# EAGLE design Mirtle_H-Bridge_proto_shield_DRV8833 (EAGLE 7.6.0)
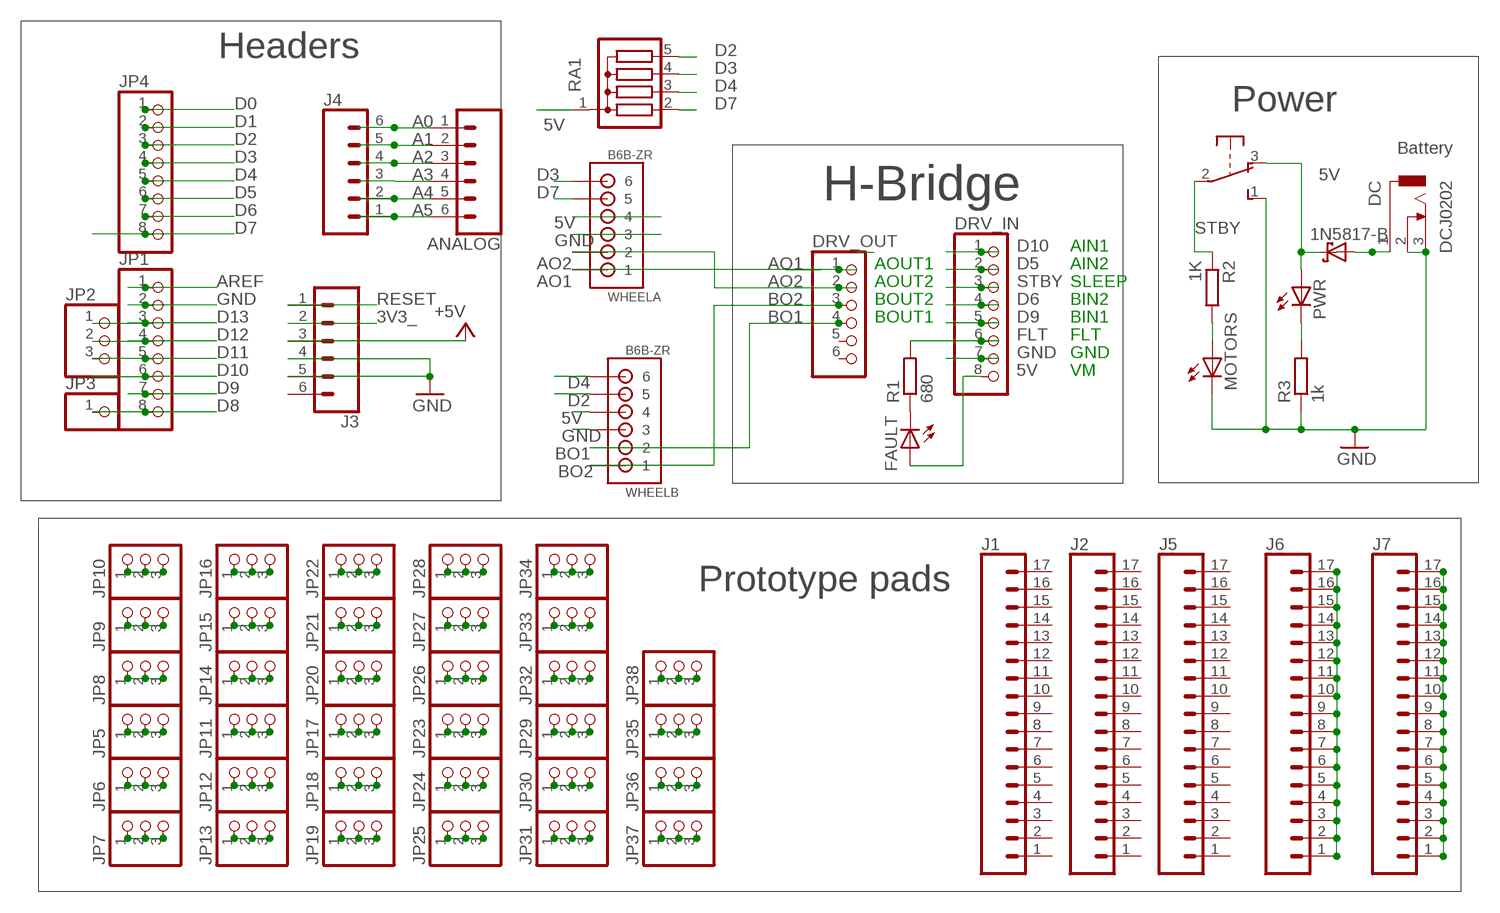
[diagram p0: schematic, sheet 1]

## Parts
ANALOG  CONN_06NO_SILK_FEMALE_PTH  [1X06_NO_SILK]
D1  1N5817-B  [DO41-7.6]
DC  DCJ0202  [DCJ0202]
DRV_IN  HEADER-1X870MIL  [1X08_ROUND_70]
DRV_OUT  PINHD-1X6CLEAN  [1X06-CLEAN]
FAULT  LED3MM  [LED3MM]
J1  CONN_17NOSILK  [1X17_NO_SILK]
J2  CONN_17NOSILK  [1X17_NO_SILK]
J3  CONN_06NO_SILK_FEMALE_PTH  [1X06_NO_SILK]
J4  CONN_06NO_SILK_FEMALE_PTH  [1X06_NO_SILK]
J5  CONN_17NOSILK  [1X17_NO_SILK]
J6  CONN_17NOSILK  [1X17_NO_SILK]
J7  CONN_17NOSILK  [1X17_NO_SILK]
JP1  PINHD-1X8CLEANBIG  [1X08-CLEANBIG]
JP2  PINHD-1X3  [1X03]
JP3  PINHD-1X1  [1X01]
JP4  PINHD-1X8CLEANBIG  [1X08-CLEANBIG]
JP5  PINHD-1X3CB  [1X03-CLEANBIG]
JP6  PINHD-1X3CB  [1X03-CLEANBIG]
JP7  PINHD-1X3CB  [1X03-CLEANBIG]
JP8  PINHD-1X3CB  [1X03-CLEANBIG]
JP9  PINHD-1X3CB  [1X03-CLEANBIG]
JP10  PINHD-1X3CB  [1X03-CLEANBIG]
JP11  PINHD-1X3CB  [1X03-CLEANBIG]
JP12  PINHD-1X3CB  [1X03-CLEANBIG]
JP13  PINHD-1X3CB  [1X03-CLEANBIG]
JP14  PINHD-1X3CB  [1X03-CLEANBIG]
JP15  PINHD-1X3CB  [1X03-CLEANBIG]
JP16  PINHD-1X3CB  [1X03-CLEANBIG]
JP17  PINHD-1X3CB  [1X03-CLEANBIG]
JP18  PINHD-1X3CB  [1X03-CLEANBIG]
JP19  PINHD-1X3CB  [1X03-CLEANBIG]
JP20  PINHD-1X3CB  [1X03-CLEANBIG]
JP21  PINHD-1X3CB  [1X03-CLEANBIG]
JP22  PINHD-1X3CB  [1X03-CLEANBIG]
JP23  PINHD-1X3CB  [1X03-CLEANBIG]
JP24  PINHD-1X3CB  [1X03-CLEANBIG]
JP25  PINHD-1X3CB  [1X03-CLEANBIG]
JP26  PINHD-1X3CB  [1X03-CLEANBIG]
JP27  PINHD-1X3CB  [1X03-CLEANBIG]
JP28  PINHD-1X3CB  [1X03-CLEANBIG]
JP29  PINHD-1X3CB  [1X03-CLEANBIG]
JP30  PINHD-1X3CB  [1X03-CLEANBIG]
JP31  PINHD-1X3CB  [1X03-CLEANBIG]
JP32  PINHD-1X3CB  [1X03-CLEANBIG]
JP33  PINHD-1X3CB  [1X03-CLEANBIG]
JP34  PINHD-1X3CB  [1X03-CLEANBIG]
JP35  PINHD-1X3CB  [1X03-CLEANBIG]
JP36  PINHD-1X3CB  [1X03-CLEANBIG]
JP37  PINHD-1X3CB  [1X03-CLEANBIG]
JP38  PINHD-1X3CB  [1X03-CLEANBIG]
MOTORS  LED3MM  [LED3MM]
PWR  LED3MM  [LED3MM]
R1  680  R-EU_0204/7  [0204/7]
R2  1K  R-EU_0204/7  [0204/7]
R3  1k  R-EU_0204/7  [0204/7]
RA1  G04R  [SIL5]
SW1  OS102011MA1Q  [OS102011MA1Q]
WHEELA  B6B-ZR  [B6B-ZR]
WHEELB  B6B-ZR  [B6B-ZR]

## Nets
3V3_: J3.2
5V: D1.C DRV_IN.8 FAULT.A J3.3 J7.1 J7.2 J7.3 J7.4 J7.5 J7.6 J7.7 J7.8 J7.9 J7.10 J7.11 J7.12 J7.13 J7.14 J7.15 J7.16 J7.17 PWR.A RA1.1 SW1.3(O) WHEELA.4 WHEELB.4 ; supply symbol labelled +5V
5VIN: D1.A DC.1
A0: ANALOG.1 J4.6
A1: ANALOG.2 J4.5
A2: ANALOG.3 J4.4
A3: ANALOG.4 J4.3
A4: ANALOG.5 J4.2
A5: ANALOG.6 J4.1
AO1: DRV_OUT.1 WHEELA.1
AO2: DRV_OUT.2 WHEELA.2
AREF: JP1.1
BO1: DRV_OUT.4 WHEELB.2
BO2: DRV_OUT.3 WHEELB.1
D0: JP4.1
D1: JP4.2
D2: JP4.3 RA1.5 WHEELB.5
D3: JP4.4 RA1.4 WHEELA.6
D4: JP4.5 RA1.3 WHEELB.6
D5: DRV_IN.2 JP4.6
D6: DRV_IN.4 JP4.7
D7: JP4.8 RA1.2 WHEELA.5
D8: JP1.8 JP3.1
D9: DRV_IN.5 JP1.7
D10: DRV_IN.1 JP1.6
D11: JP1.5 JP2.3
D12: JP1.4 JP2.2
D13: JP1.3 JP2.1
FLT: DRV_IN.6 R1.2
GND: DC.2 DC.3 DRV_IN.7 J3.4 J3.5 J6.1 J6.2 J6.3 J6.4 J6.5 J6.6 J6.7 J6.8 J6.9 J6.10 J6.11 J6.12 J6.13 J6.14 J6.15 J6.16 J6.17 JP1.2 MOTORS.K(C) R3.1 SW1.1(S) WHEELA.3 WHEELB.3
N$5: PWR.K(C) R3.2
N$10: FAULT.K(C) R1.1
N$12: JP7.1 JP7.2 JP7.3 JP10.1 JP10.2 JP10.3 JP11.1 JP11.2 JP11.3 JP12.1 JP12.2 JP12.3 JP13.1 JP13.2 JP13.3 JP14.1 JP14.2 JP14.3 JP15.1 JP15.2 JP15.3 JP16.1 JP16.2 JP16.3 JP22.1 JP22.2 JP22.3 JP28.1 JP28.2 JP28.3 JP34.1 JP34.2 JP34.3
N$15: JP9.1 JP9.2 JP9.3
N$16: MOTORS.A R2.2
N$17: JP8.1 JP8.2 JP8.3
N$24: JP5.1 JP5.2 JP5.3
N$27: JP17.1 JP17.2 JP17.3 JP18.1 JP18.2 JP18.3 JP19.1 JP19.2 JP19.3 JP20.1 JP20.2 JP20.3 JP21.1 JP21.2 JP21.3 JP23.1 JP23.2 JP23.3 JP24.1 JP24.2 JP24.3 JP25.1 JP25.2 JP25.3 JP26.1 JP26.2 JP26.3 JP27.1 JP27.2 JP27.3 JP29.1 JP29.2 JP29.3 JP30.1 JP30.2 JP30.3 JP31.1 JP31.2 JP31.3 JP32.1 JP32.2 JP32.3 JP33.1 JP33.2 JP33.3 JP35.1 JP35.2 JP35.3 JP36.1 JP36.2 JP36.3 JP37.1 JP37.2 JP37.3 JP38.1 JP38.2 JP38.3
N$31: JP6.1 JP6.2 JP6.3
RESET: J3.1
STBY: DRV_IN.3 R2.1 SW1.2(P)
Unconnected: DRV_OUT.5 DRV_OUT.6 J1.1 J1.2 J1.3 J1.4 J1.5 J1.6 J1.7 J1.8 J1.9 J1.10 J1.11 J1.12 J1.13 J1.14 J1.15 J1.16 J1.17 J2.1 J2.2 J2.3 J2.4 J2.5 J2.6 J2.7 J2.8 J2.9 J2.10 J2.11 J2.12 J2.13 J2.14 J2.15 J2.16 J2.17 J3.6 J5.1 J5.2 J5.3 J5.4 J5.5 J5.6 J5.7 J5.8 J5.9 J5.10 J5.11 J5.12 J5.13 J5.14 J5.15 J5.16 J5.17 SW1.MT1(MT) SW1.MT2(MT)

## Notes on the sheet
- Headers
- Power
- Battery
- H-Bridge
- AIN1
- AOUT1 | AIN2
- AOUT2 | SLEEP
- BOUT2 | BIN2
- BOUT1 | BIN1
- FLT
- GND
- VM
- Prototype pads

## Library data of the parts
ANALOG J3 J4 = SparkFun-Connectors:CONN_06: Multi connection point. Often used as Generic Header-pin footprint for 0.1 inch spaced/style header connections On any of the 0.1 inch spaced packages, you can populate with these: Break Away Headers - Straight <https://www.sparkfun.com/products/116> (PRT-00116) Break Away Male Headers - Right Angle <https://www.sparkfun.com/products/553> (PRT-00553) Female Headers <https://www.sparkfun.com/products/115> (PRT-00115) Break Away Headers - Machine Pin <https://www.sparkfun.com/products/117> (PRT-00117) Break Away Female Headers - Swiss Machine Pin <https://www.sparkfun.com/products/743> (PRT-00743) Arduino Stackable Header - 6 Pin <https://www.sparkfun.com/products/9280> (PRT-09280) For SCREWTERMINALS and SPRING TERMINALS visit here: Screw Terimnals on SparkFun.com <https://www.sparkfun.com/search/results?term=Screw+Terminals> (5mm/3.5mm/2.54mm spacing) This device is also useful as a general connection point to wire up your design to another part of your project. Our various solder wires solder well into these plated through hole pads. Hook-Up Wire - Assortment (Stranded, 22 AWG) <https://www.sparkfun.com/products/11375> (PRT-11375) Hook-Up Wire - Assortment (Solid Core, 22 AWG) <https://www.sparkfun.com/products/11367> (PRT-11367) View the entire wire category on our website here <https://www.sparkfun.com/categories/141>; PROD_ID: CONN-08437
D1 = diode:1N581*: 1.0A SCHOTTKY BARRIER RECTIFIER Source: http://www.diodes.com/datasheets/ds23001.pdf
DC = con-jack:DCJ0202: DC POWER JACK Source: DCJ0202.pdf; OC_FARNELL: unknown; OC_NEWARK: unknown
DRV_IN = microbuilder:HEADER-1X8: PIN HEADER
DRV_OUT = adafruit:PINHD-1X6: PIN HEADER
FAULT MOTORS PWR = led:LED: LED OSRAM: - CHIPLED LG R971, LG N971, LY N971, LG Q971, LY Q971, LO R971, LY R971 LH N974, LH R974 LS Q976, LO Q976, LY Q976 LO Q996 - Hyper CHIPLED LW Q18S LB Q993, LB Q99A, LB R99A - SideLED LS A670, LO A670, LY A670, LG A670, LP A670 LB A673, LV A673, LT A673, LW A673 LH A674 LY A675 LS A676, LA A676, LO A676, LY A676, LW A676 LS A679, LY A679, LG A679 - Hyper Micro SIDELED® LS Y876, LA Y876, LO Y876, LY Y876 LT Y87S - SmartLED LW L88C, LW L88S LB L89C, LB L89S, LG L890 LS L89K, LO L89K, LY L89K LS L896, LA L896, LO L896, LY L896 - TOPLED LS T670, LO T670, LY T670, LG T670, LP T670 LSG T670, LSP T670, LSY T670, LOP T670, LYG T670 LG T671, LOG T671, LSG T671 LB T673, LV T673, LT T673, LW T673 LH T674 LS T676, LA T676, LO T676, LY T676, LB T676, LH T676, LSB T676, LW T676 LB T67C, LV T67C, LT T67C, LS T67K, LO T67K, LY T67K, LW E67C LS E67B, LA E67B, LO E67B, LY E67B, LB E67C, LV E67C, LT E67C LW T67C LS T679, LY T679, LG T679 LS T770, LO T770, LY T770, LG T770, LP T770 LB T773, LV T773, LT T773, LW T773 LH T774 LS E675, LA E675, LY E675, LS T675 LS T776, LA T776, LO T776, LY T776, LB T776 LHGB T686 LT T68C, LB T68C - Hyper Mini TOPLED® LB M676 - Mini TOPLED Santana® LG M470 LS M47K, LO M47K, LY M47K Source: http://www.osram.convergy.de LUXEON: - LUMILED® LXK2-PW12-R00, LXK2-PW12-S00, LXK2-PW14-U00, LXK2-PW14-V00 LXK2-PM12-R00, LXK2-PM12-S00, LXK2-PM14-U00 LXK2-PE12-Q00, LXK2-PE12-R00, LXK2-PE12-S00, LXK2-PE14-T00, LXK2-PE14-U00 LXK2-PB12-K00, LXK2-PB12-L00, LXK2-PB12-M00, LXK2-PB14-N00, LXK2-PB14-P00, LXK2-PB14-Q00 LXK2-PR12-L00, LXK2-PR12-M00, LXK2-PR14-Q00, LXK2-PR14-R00 LXK2-PD12-Q00, LXK2-PD12-R00, LXK2-PD12-S00 LXK2-PH12-R00, LXK2-PH12-S00 LXK2-PL12-P00, LXK2-PL12-Q00, LXK2-PL12-R00 Source: www.luxeon.com KINGBRIGHT: KA-3528ASYC Source: www.kingbright.com
J1 J2 J5-J7 = SparkFun-Connectors:CONN_17: Multi connection point. Often used as Generic Header-pin footprint for 0.1 inch spaced/style header connections On any of the 0.1 inch spaced packages, you can populate with these: Break Away Headers - Straight <https://www.sparkfun.com/products/116> (PRT-00116) Break Away Male Headers - Right Angle <https://www.sparkfun.com/products/553> (PRT-00553) Female Headers <https://www.sparkfun.com/products/115> (PRT-00115) Break Away Headers - Machine Pin <https://www.sparkfun.com/products/117> (PRT-00117) Break Away Female Headers - Swiss Machine Pin <https://www.sparkfun.com/products/743> (PRT-00743) For SCREWTERMINALS and SPRING TERMINALS visit here: Screw Terimnals on SparkFun.com <https://www.sparkfun.com/search/results?term=Screw+Terminals> (5mm/3.5mm/2.54mm spacing) This device is also useful as a general connection point to wire up your design to another part of your project. Our various solder wires solder well into these plated through hole pads. Hook-Up Wire - Assortment (Stranded, 22 AWG) <https://www.sparkfun.com/products/11375> (PRT-11375) Hook-Up Wire - Assortment (Solid Core, 22 AWG) <https://www.sparkfun.com/products/11367> (PRT-11367) View the entire wire category on our website here <https://www.sparkfun.com/categories/141> Special notes: Molex polarized connector foot print use with SKU : PRT-08231 with associated crimp pins and housings. 1MM SMD Version SKU: PRT-10208 NOTES ON THE VARIANTS LOCK and LOCK_LONGPADS... This footprint was designed to help hold the alignment of a through-hole component (i.e. 6-pin header) while soldering it into place. You may notice that each hole has been shifted either up or down by 0.005 of an inch from it's more standard position (which is a perfectly straight line). This slight alteration caused the pins (the squares in the middle) to touch the edges of the holes. Because they are alternating, it causes a "brace" to hold the component in place. 0.005 has proven to be the perfect amount of "off-center" position when using our standard breakaway headers. Although looks a little odd when you look at the bare footprint, once you have a header in there, the alteration is very hard to notice. Also,if you push a header all the way into place, it is covered up entirely on the bottom side.
JP1 JP4 = adafruit:PINHD-1X8: PIN HEADER
JP2 JP5-JP38 = adafruit:PINHD-1X3: PIN HEADER
JP3 = adafruit:PINHD-1X1: Pin header 1x1 for 0.1" spacing With round pins
R1-R3 = resistor:R-EU_: RESISTOR, European symbol
RA1 = resistor-sil:G04R: SIL RESISTOR; OC_FARNELL: unknown; OC_NEWARK: unknown
SW1 = adafruit_mem:OS102011MA1Q: OS10201MA1Q through-hole right angle switch http://www.ladyada.net/library/eagle
WHEELA WHEELB = jst:B6B-ZR: JST-ZH Connector 6 pol, 1.5mm pitch Package: B6B-ZR Source: http://www.jst-mfg.com/product/pdf/eng/eZH.pdf

## Board
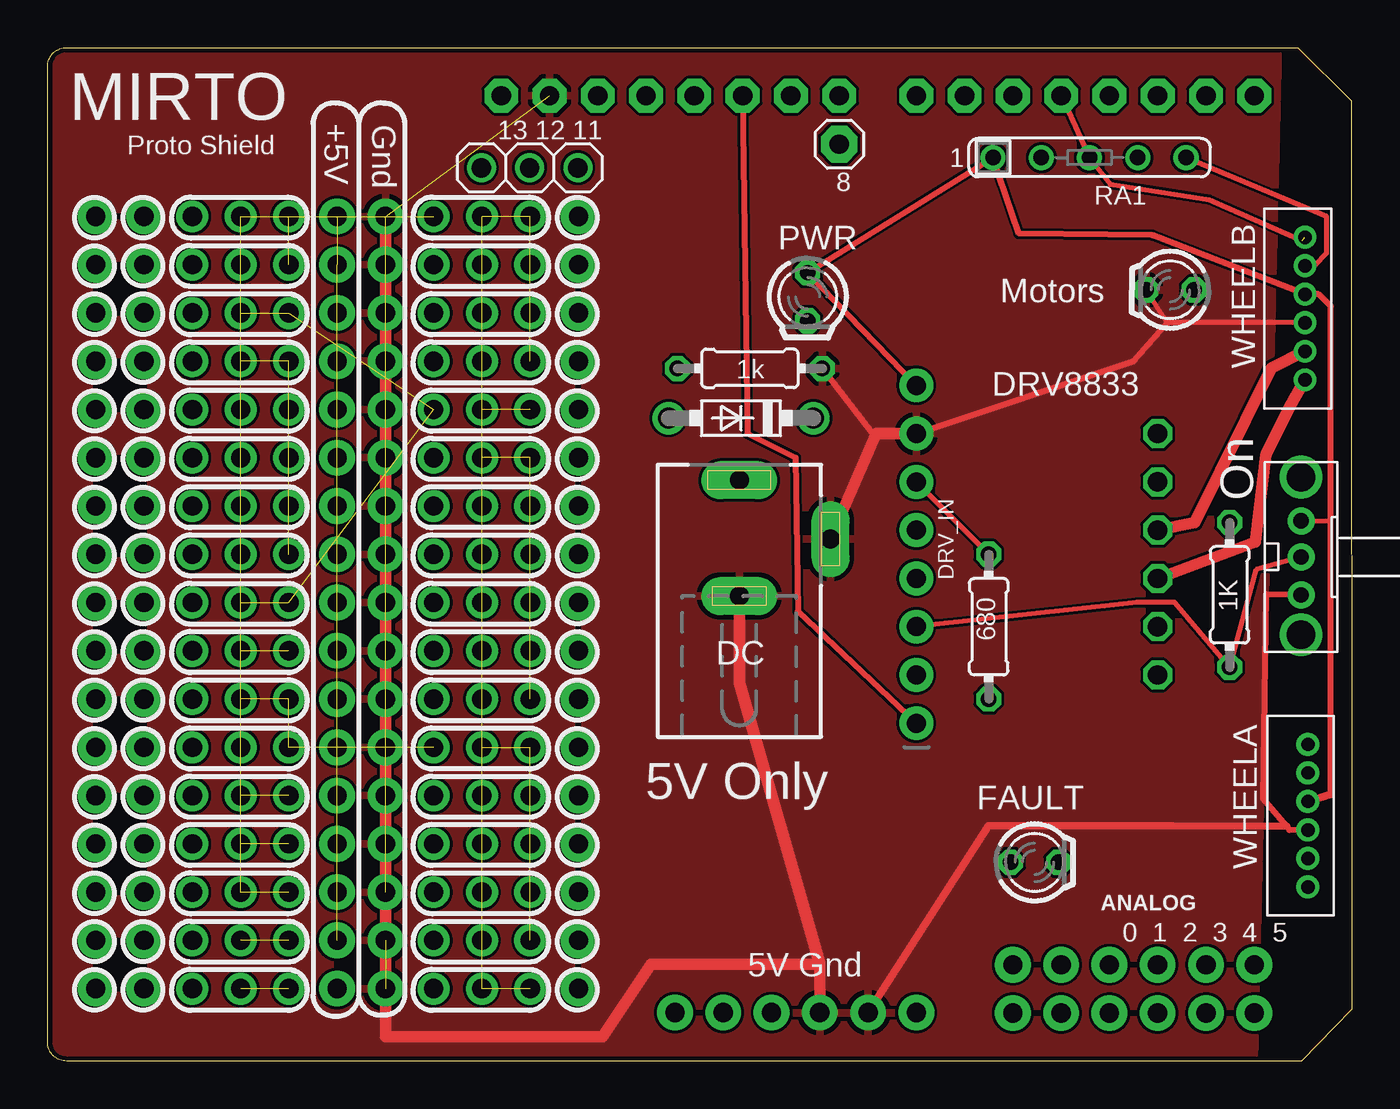
[diagram p1: board, top side]
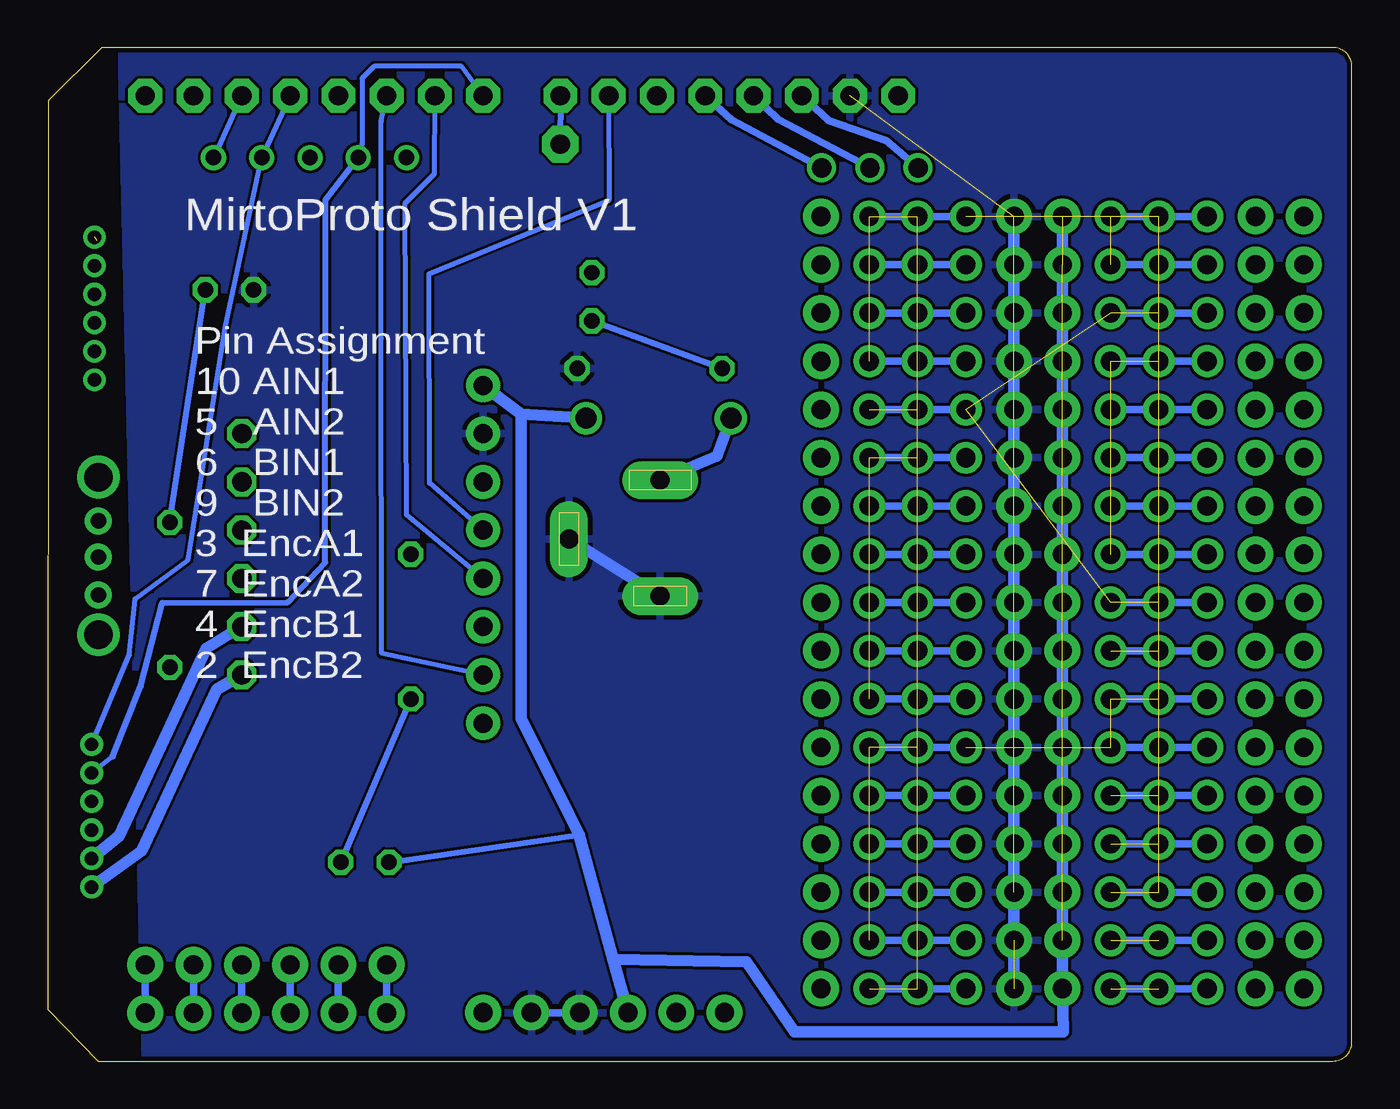
[diagram p2: board, bottom side, seen from below]

Size 68.64 x 53.34 mm. Coordinates in mm from the lower left corner, seen from the top.
Outline: 65.79,53.34 68.61,50.55 68.64,2.73 65.98,0 1,0 arc-90 0,1 0,52.34 arc-90 1,53.34 65.79,53.34
Copper layers (1*16): Top 0.035mm / dielectric 1.5mm / Bottom 0.035mm
Design rules "SeeedStudio_2layer_DRU_no_angle_20140221": minimum track width 6mil, minimum drill 12mil, track to track 6mil, track to pad 6mil, pad to pad 6mil, via to via 6mil, smd to smd 0mil, copper to edge 10mil, drill to drill 10mil, minimum pad ring 10mil, minimum via ring 6mil, stop-mask expansion 2mil, vias tented up to drill 100mil, thermal gap 10mil

### Footprints (pad centres in the part's own frame; a part is rotated, then mirrored left to right if it is on the bottom)
1X06_NO_SILK = drill 1.016 pad 1.88: 1 0,0; 2 2.54,0; 3 5.08,0; 4 7.62,0; 5 10.16,0; 6 12.7,0
DO41-7.6 = drill 1.1 pad 1.7: A 3.81,0; C -3.81,0
DCJ0202 = drill 1 pad 2 long: 1 0,3.1; 2 4.8,0; 3 0,-3
1X08_ROUND_70 = drill 1 pad 1.778: 1 -8.89,0; 2 -6.35,0; 3 -3.81,0; 4 -1.27,0; 5 1.27,0; 6 3.81,0; 7 6.35,0; 8 8.89,0
1X06-CLEAN = drill 1.016 octagon: 1 -6.35,0; 2 -3.81,0; 3 -1.27,0; 4 1.27,0; 5 3.81,0; 6 6.35,0
LED3MM = drill 0.813 octagon: A -1.27,0; K 1.27,0
1X17_NO_SILK = drill 1.016 pad 1.88: 1 0,0; 2 2.54,0; 3 5.08,0; 4 7.62,0; 5 10.16,0; 6 12.7,0; 7 15.24,0; 8 17.78,0; 9 20.32,0; 10 22.86,0; 11 25.4,0; 12 27.94,0; 13 30.48,0; 14 33.02,0; 15 35.56,0; 16 38.1,0; 17 40.64,0
1X08-CLEANBIG = drill 1.016 pad 1.778 octagon: 1 -8.89,0; 2 -6.35,0; 3 -3.81,0; 4 -1.27,0; 5 1.27,0; 6 3.81,0; 7 6.35,0; 8 8.89,0
1X03 = drill 1.016: 1 -2.54,0; 2 0,0; 3 2.54,0
1X01 = drill 1.016 pad 1.93 octagon: 1 0,0
1X03-CLEANBIG = drill 1.016 pad 1.676: 1 -2.54,0; 2 0,0; 3 2.54,0
0204/7 = drill 0.813 octagon: 1 -3.81,0; 2 3.81,0
SIL5 = drill 0.813: 1 -5.08,0; 2 -2.54,0; 3 0,0; 4 2.54,0; 5 5.08,0
OS102011MA1Q = drill 0.8 pad 1.422: 1 -2,0; 2 0,0; 3 1.9,0 | drill 1.5 pad 2.184: MT1 -4.1,0; MT2 4.2,0
B6B-ZR = drill 0.7: 1 9,-1.3; 2 7.5,-1.3; 3 6,-1.3; 4 4.5,-1.3; 5 3,-1.3; 6 1.5,-1.3

### Placement (x,y rotation side)
ANALOG  50.8,5.07 0 top
D1  36.49,33.83 180 top
DC  36.4,27.47 0 top
DRV_IN  45.72,26.67 90 top
DRV_OUT  58.42,26.67 90 top
FAULT  51.94,10.46 0 top
J1  27.94,3.81 90 top
J2  5.08,3.81 90 top
J3  33.02,2.55 0 top
J4  63.5,2.53 180 top
J5  2.54,3.81 90 top
J6  17.78,3.81 90 top
J7  15.24,3.81 90 top
JP1  32.77,50.8 0 top
JP2  25.37,47.01 0 top
JP3  41.66,48.25 0 top
JP4  54.61,50.8 180 top
JP5  10.16,3.81 0 top
JP6  10.16,6.35 0 top
JP7  10.16,8.89 0 top
JP8  10.16,11.43 0 top
JP9  10.16,13.97 0 top
JP10  10.16,16.51 0 top
JP11  10.16,19.05 0 top
JP12  22.86,16.51 0 top
JP13  22.86,13.97 0 top
JP14  22.86,11.43 0 top
JP15  22.86,8.89 0 top
JP16  22.86,6.35 0 top
JP17  22.86,3.81 0 top
JP18  22.86,19.05 0 top
JP19  10.16,41.91 0 top
JP20  10.16,44.45 0 top
JP21  10.16,36.83 0 top
JP22  10.16,39.37 0 top
JP23  10.16,31.75 0 top
JP24  10.16,34.29 0 top
JP25  10.16,26.67 0 top
JP26  10.16,29.21 0 top
JP27  10.16,21.59 0 top
JP28  10.16,24.13 0 top
JP29  22.86,21.59 0 top
JP30  22.86,24.13 0 top
JP31  22.86,26.67 0 top
JP32  22.86,29.21 0 top
JP33  22.86,31.75 0 top
JP34  22.86,34.29 0 top
JP35  22.86,36.83 0 top
JP36  22.86,39.37 0 top
JP37  22.86,41.91 0 top
JP38  22.86,44.45 0 top
MOTORS  59.08,40.58 180 top
PWR  40,40.22 270 top
R1  49.53,22.86 90 top
R2  62.21,24.53 90 top
R3  36.96,36.45 180 top
RA1  54.83,47.55 0 top
SW1  65.97,26.53 90 top
WHEELA  67.63,18.16 270 top
WHEELB  67.47,44.85 270 top

### Tracks (layer width: path | path; a pad name or v marks a point on that pad's centre or on a via)
5V  (15 unrouted)
  Top 0.254: SW1.3 67.52,28.44
  Top 0.305: 67.53,14.03 67.52,28.44 67.53,39.72 66.89,40.36 WHEELB.4 58.14,43.46 51.12,43.55 RA1.1 PWR.A DRV_IN.8
  Top 0.406: 67.53,14.03 WHEELA.4
  Bottom 0.305: FAULT.A 40.68,11.89
  Bottom 0.61: 43.73,34.04 43.72,18.02 40.65,11.89 40.68,11.89 38.88,5.36 | 43.73,34.04 DRV_IN.8 | D1.C 43.73,34.04 | J3.3 38.88,5.36 | J7.17 J7.1 15.2,1.55 29.33,1.55 31.86,5.23 38.88,5.36
5VIN
  Bottom 0.61: DC.1 33.41,31.84 D1.A
A0
  Bottom 0.406: ANALOG.1 J4.6
A1
  Bottom 0.406: ANALOG.2 J4.5
A2
  Bottom 0.406: ANALOG.3 J4.4
A3
  Bottom 0.406: ANALOG.4 J4.3
A4
  Bottom 0.406: ANALOG.5 J4.2
A5
  Bottom 0.406: ANALOG.6 J4.1
AO1
  Bottom 0.61: WHEELA.1 63.68,11.07 59.74,19.57 DRV_OUT.1
AO2
  Bottom 0.61: DRV_OUT.2 60.3,21.71 64.86,11.84 WHEELA.2
BO1
  Top 0.61: WHEELB.2 64.39,36.48 60.38,28.33 DRV_OUT.4
BO2
  Top 0.61: WHEELB.1 65.36,34.44 64.12,31.89 63.54,27.32 DRV_OUT.3
D2
  Top 0.254: WHEELB.5 66.71,41.88 67.31,42.51 67.31,44.45 RA1.5
  Bottom 0.254: JP4.3 RA1.5
D3
  Bottom 0.254: WHEELA.6 64.34,21.36 64.03,24.33 61.25,26.38 59.28,38.58 RA1.4 JP4.4
D4  (1 unrouted)
  Top 0.254: 66.04,43.18 61.13,45.33 55.92,46.14 RA1.3 JP4.5
D5
  Bottom 0.254: DRV_IN.2 51.06,21.46 51.08,38.03 51.08,49.46 JP4.6
D6
  Bottom 0.254: JP4.7 48.28,46.7 49.82,45.16 49.75,28.74 DRV_IN.4
D7
  Bottom 0.254: JP4.8 46.86,52.35 51.45,52.35 52.09,51.72 52.09,48.27 RA1.2 | 65.2,16.03 WHEELA.5
  Bottom 0.305: 65.2,16.03 63.73,19.74 62.6,24.12 56.01,24.14 54.02,26.25 54.01,45.33 RA1.2
D8
  Bottom 0.305: JP1.8 JP3.1
D9
  Bottom 0.254: JP1.7 39.1,45.3 48.57,41.43 48.54,30.41 DRV_IN.5
D10
  Top 0.305: JP1.6 36.83,33.02 39.37,31.75 39.48,23.67 DRV_IN.1
D11
  Bottom 0.406: JP1.5 32.64,49.55 JP2.3
D12
  Bottom 0.406: JP1.4 30.2,49.58 JP2.2
D13
  Bottom 0.406: JP1.3 27.53,49.5 24.5,48.43 JP2.1
FLT
  Top 0.254: DRV_IN.6 R1.2
GND  (16 unrouted)
  Top 0.254: MOTORS.K 58.93,38.85 WHEELB.3
  Top 0.305: DRV_IN.7 57.15,36.83 58.93,38.85 | WHEELA.3 65.37,12.15 65.2,12.35 63.96,13.83 64.11,24.56 SW1.1 | R3.1 43.55,32.86
  Top 0.406: J3.5 49.51,12.37 59.25,12.37 65.2,12.35
  Top 0.61: DC.2 43.55,32.86 43.62,33.02 DRV_IN.7 | J3.4 40.64,5.08 | 40.64,5.08 36.4,19.91 DC.3 | J6.17 J6.1 17.78,1.27 29.21,1.27 31.75,5.08 40.64,5.08
  Bottom 0.406: J3.4 J3.5
  Bottom 0.61: DC.2 DC.3 | J6.17 J6.1
  pour Top: 0,53.34 0,0 63.5,0 64.77,53.34
  pour Bottom: 0,53.34 0,0 63.5,0 64.77,53.34
N$5
  Bottom 0.305: R3.2 PWR.K
N$10
  Bottom 0.305: R1.1 FAULT.K
N$12  (21 unrouted)
  Bottom 0.406: JP10.1 JP10.3 | JP7.1 JP7.3 | JP11.1 JP11.3 | JP16.1 JP16.3 | JP15.1 JP15.3 | JP14.1 JP14.3 | JP13.1 JP13.3 | JP12.1 JP12.3 | JP34.3 JP34.1 | JP22.3 JP22.1 | JP28.1 JP28.3
N$15  (1 unrouted)
  Bottom 0.406: JP9.3 JP9.1
N$16
  Bottom 0.305: R2.2 MOTORS.A
N$17  (1 unrouted)
  Bottom 0.406: JP8.3 JP8.1
N$24  (1 unrouted)
  Bottom 0.406: JP5.3 JP5.1
N$27  (37 unrouted)
  Bottom 0.406: JP27.1 JP27.3 | JP17.1 JP17.3 | JP18.1 JP18.3 | JP29.1 JP29.3 | JP30.3 JP30.1 | JP31.3 JP31.1 | JP32.3 JP32.1 | JP33.3 JP33.1 | JP35.3 JP35.1 | JP36.3 JP36.1 | JP37.3 JP37.1 | JP38.3 JP38.1 | JP20.3 JP20.1 | JP19.3 JP19.1 | JP21.3 JP21.1 | JP24.3 JP24.1 | JP23.3 JP23.1 | JP26.3 JP26.1 | JP25.3 JP25.1
N$31  (1 unrouted)
  Bottom 0.406: JP6.1 JP6.3
STBY
  Top 0.254: DRV_IN.3 57.31,24.14 59.31,24.14 R2.1 63.62,25.86 SW1.2

### Text on the board
tPlace: MIRTO | 13 12 11 | Proto Shield | 8 | Motors | 0 1 2 3 4 5
bPlace: MirtoProto Shield V1 | Pin Assignment / 10 AIN1 / 5 AIN2 / 6 BIN1 / 9 BIN2 / 3 EncA1 / 7 EncA2 / 4 EncB1 / 2 EncB2
tNames: +5V | Gnd | DRV8833 | On | 5V Only | 5V Gnd